# Altium schematic sheet Connectors.SchDoc
size A4; CompanyName: Technische Hochschule Nürnberg Georg Simon Ohm; Organization: UltraZohm; Address1: Kesslerplatz 12; Address2: 90489 Nürnberg; Address3: GERMANY; Website: www.ultrazohm.com
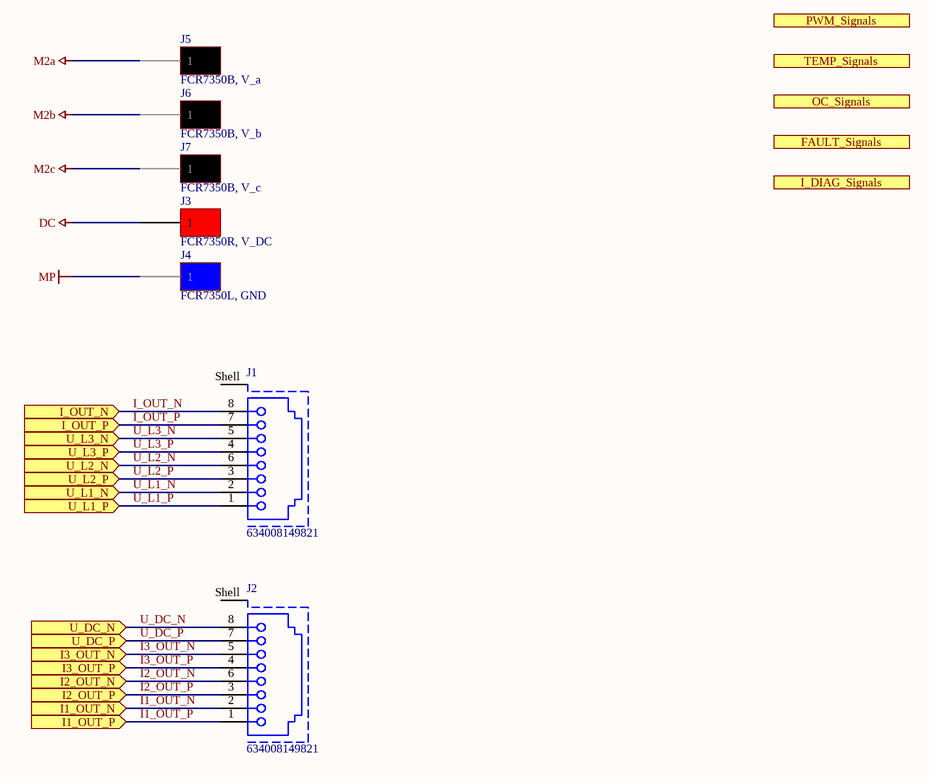
[diagram p0: Connectors.SchDoc]

## Parts
J1  634008149821  [634008149821]
J2  634008149821  [634008149821]
J3  FCR7350R, V_DC  [FCR7350]
J4  FCR7350L, GND  [FCR7350]
J5  FCR7350B, V_a  [FCR7350]
J6  FCR7350B, V_b  [FCR7350]
J7  FCR7350B, V_c  [FCR7350]

## Ports
FAULT_Signals (harness FAULT_Signals), I1_OUT_N (in), I1_OUT_P (in), I2_OUT_N (in), I2_OUT_P (in), I3_OUT_N (in), I3_OUT_P (in), I_DIAG_Signals (harness I_DIAG_Signals), I_OUT_N (in), I_OUT_P (in), OC_Signals (harness OT_Signals), PWM_Signals (harness PWM_Signals), TEMP_Signals (harness Temperature_Signals), U_DC_N (in), U_DC_P (in), U_L1_N (in), U_L1_P (in), U_L2_N (in), U_L2_P (in), U_L3_N (in), U_L3_P (in)

## Nets
DC: J3.1
M2a: J5.1
M2b: J6.1
M2c: J7.1
MP: J4.1
I1_OUT_N: J2.2 ; port I1_OUT_N
I1_OUT_P: J2.1 ; port I1_OUT_P
I2_OUT_N: J2.6 ; port I2_OUT_N
I2_OUT_P: J2.3 ; port I2_OUT_P
I3_OUT_N: J2.5 ; port I3_OUT_N
I3_OUT_P: J2.4 ; port I3_OUT_P
I_OUT_N: J1.8 ; port I_OUT_N
I_OUT_P: J1.7 ; port I_OUT_P
U_DC_N: J2.8 ; port U_DC_N
U_DC_P: J2.7 ; port U_DC_P
U_L1_N: J1.2 ; port U_L1_N
U_L1_P: J1.1 ; port U_L1_P
U_L2_N: J1.6 ; port U_L2_N
U_L2_P: J1.3 ; port U_L2_P
U_L3_N: J1.5 ; port U_L3_N
U_L3_P: J1.4 ; port U_L3_P

Not connected (* = marked no-connect by the designer): J1 Shell; J2 Shell

## Notes on the sheet
- Title
- Revision:
- Design Engineer:
- Date:
- Project:
- Sheet
- of

## Library data of the parts
J1 J2 = 634008149821: CAT5, RJ45 Connector, 1 port SMD; Manufacturer: Wuerth Elektronik; Match Code: WR-MJ; Contact Resistance: 20mOhm; Insulation Resistance: 500MOhm; LED: No; Number of Ports: 1; Rated Current: 1.5A; Shielding: Yes; Working Voltage: 120VAC; Withstanding Voltage: 1000VAC; Created from: DHufnagel; ComponentLink1Description: Datasheet; ComponentLink1URL: https://www.mouser.de/datasheet/2/445/634008149821-1718453.pdf; ComponentLink2Description: Datasheet; ComponentLink2URL: https://www.we-online.com/redexpert/spec/634008149821?ad; Category: Input/Output Connectors; Manufacturer Part Number: 634008149821; Mount: Surface Mount; Operating Temperature Max: 85°C; Operating Temperature Min: -40°C; Packaging: Tray; Number of Pins: 8P8C; Orientation: Horizontal; PartID: 6; Created On: 15.06.2022 07:42:55; Component Type: RJ45 Connector; Device Package: RJ45; Last Updated: 15.06.2022 07:42:55; Mounting Type: SMD; Series: WR-MJ; Supplier 1: Mouser; Supplier Part Number 1: 710-634008149821; Type: RJ45 Connector; Live Cycle Status: 1; Stock number: not stored
J3 = FCR7350R: FCR7350B, 1000V, 24A, RED; Manufacturer: Cliff; Value: PCB mount 4mm jack, Red FCR7350R, 1000V, 24A; Created from: DHufnagel; Manufacturer Part Number: FCR7350R; PartID: 7; Created On: 13.06.2022 10:18:11; ComponentLink1Description: datasheet; ComponentLink1URL: https://www.cliffuk.co.uk/products/testleads/sockets/S16NPC.pdf; ComponentLink2Description: drawing; ComponentLink2URL: https://media.digikey.com/pdf/Data%20Sheets/Cliff%20Electronic%20LTD%20PDF's/FCR7350_Drawing.pdf; Component Type: PCB mount 4mm jack, Red; Device Package: THT; Last Updated: 28.06.2022 13:58:37; Minimum Order: 1; Mounting Type: THT; Operating Temperature: -40°C - 80°C; Series: S16N-PC; Supplier 1: Digi-Key; Supplier Part Number 1: 3185-FCR7350R-ND; Supplier 2: farnell; Supplier Part Number 2: 1854508; Type: PCB mount 4mm jack, Red FCR7350R, 1000V, 24A; Live Cycle Status: 1; Stock number: not stored
J4 = FCR7350L: FCR7350B, 1000V, 24A, BLUE; Manufacturer: Cliff; Value: PCB mount 4mm jack, Blue FCR7350L, 1000V, 24A; Created from: DHufnagel; Manufacturer Part Number: FCR7350L; PartID: 8; Created On: 13.06.2022 10:18:11; ComponentLink1Description: datasheet; ComponentLink1URL: https://www.cliffuk.co.uk/products/testleads/sockets/S16NPC.pdf; ComponentLink2Description: drawing; ComponentLink2URL: https://media.digikey.com/pdf/Data%20Sheets/Cliff%20Electronic%20LTD%20PDF's/FCR7350_Drawing.pdf; Component Type: PCB mount 4mm jack, Blue; Device Package: THT; Last Updated: 28.06.2022 13:58:37; Minimum Order: 1; Mounting Type: THT; Operating Temperature: -40°C - 80°C; Series: S16N-PC; Supplier 1: Digi-Key; Supplier Part Number 1: 3185-FCR7350L-ND; Supplier 2: farnell; Supplier Part Number 2: 1854511; Type: PCB mount 4mm jack, Blue FCR7350L, 1000V, 24A; Live Cycle Status: 1; Stock number: not stored
J5-J7 = FCR7350B: FCR7350B, 1000V, 24A, BLACK; Manufacturer: Cliff; Value: PCB mount 4mm jack, Black	FCR7350B, 1000V, 24A; Created from: DHufnagel; Manufacturer Part Number: FCR7350B; PartID: 6; Created On: 13.06.2022 10:18:11; ComponentLink1Description: datasheet; ComponentLink1URL: https://www.cliffuk.co.uk/products/testleads/sockets/S16NPC.pdf; ComponentLink2Description: drawing; ComponentLink2URL: https://media.digikey.com/pdf/Data%20Sheets/Cliff%20Electronic%20LTD%20PDF's/FCR7350_Drawing.pdf; Component Type: PCB mount 4mm jack, Black; Device Package: THT; Last Updated: 28.06.2022 13:58:37; Minimum Order: 1; Mounting Type: THT; Operating Temperature: -40°C - 80°C; Series: S16N-PC; Supplier 1: Digi-Key; Supplier Part Number 1: 3185-FCR7350B-ND; Supplier 2: farnell; Supplier Part Number 2: 1854507; Type: PCB mount 4mm jack, Black	FCR7350B, 1000V, 24A; Live Cycle Status: 1; Stock number: not stored